# Altium schematic sheet MAX5875_3.SchDoc
size A; SheetNumber: 16; SheetTotal: 24
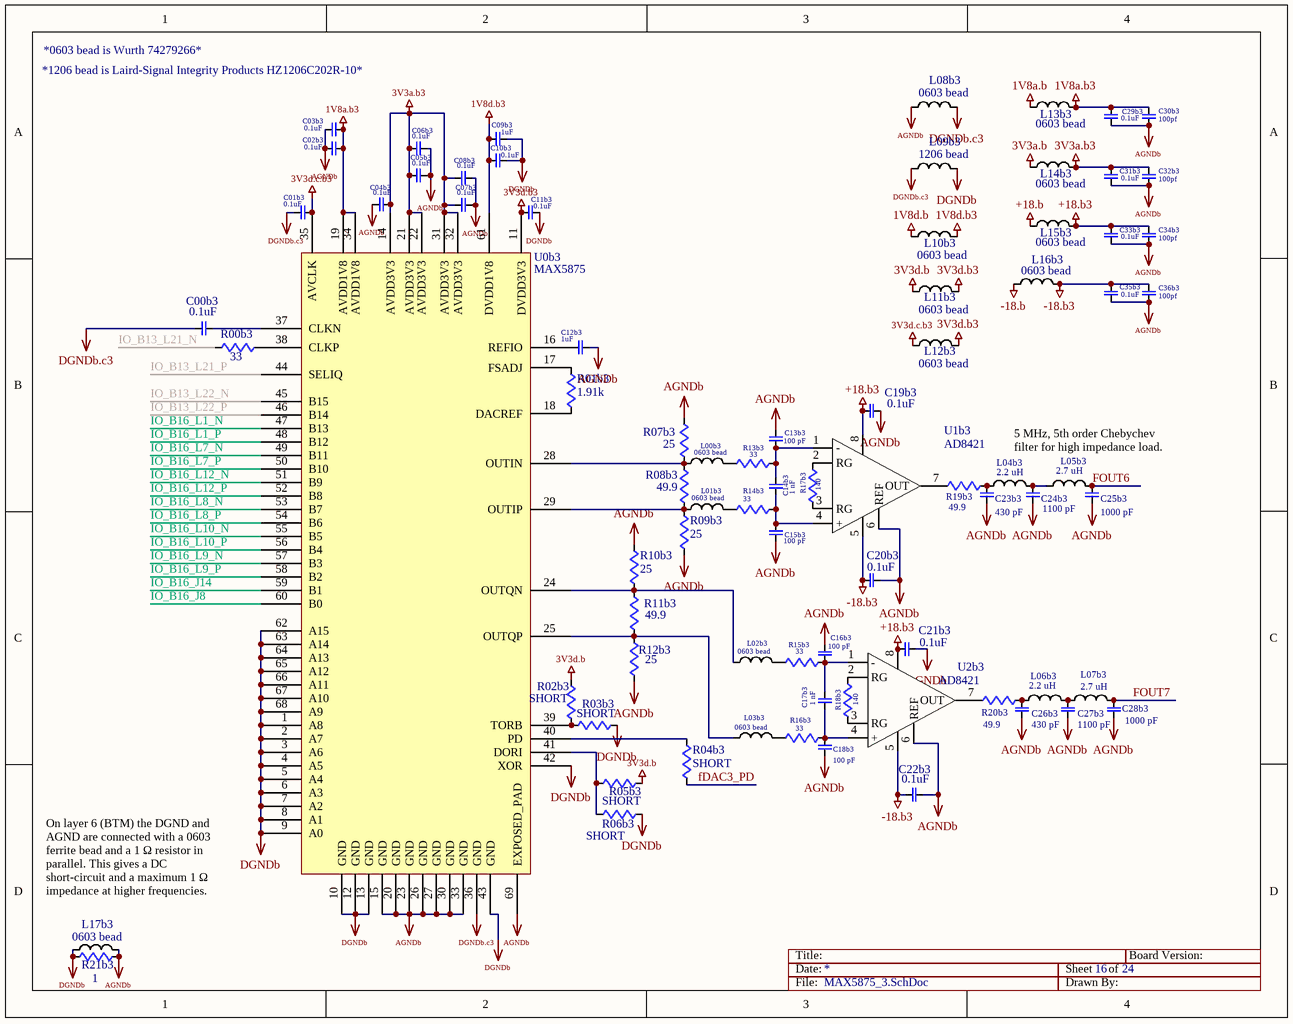
[diagram p0: MAX5875_3.SchDoc]

## Parts
C00b3  0.1uF  [0402]
C01b3  0.1uF  [0402]
C02b3  0.1uF  [0402]
C03b3  0.1uF  [0402]
C04b3  0.1uF  [0402]
C05b3  0.1uF  [0402]
C06b3  0.1uF  [0402]
C07b3  0.1uF  [0402]
C08b3  0.1uF  [0402]
C09b3  1uF  [0603]
C10b3  0.1uF  [0402]
C11b3  0.1uF  [0402]
C12b3  1uF  [0402]
C13b3  100 pF  [0603]
C14b3  1 nF  [0603]
C15b3  100 pF  [0603]
C16b3  100 pF  [0603]
C17b3  1 nF  [0603]
C18b3  100 pF  [0603]
C19b3  0.1uF  [0603]
C20b3  0.1uF  [0603]
C21b3  0.1uF  [0603]
C22b3  0.1uF  [0603]
C23b3  430 pF  [0603]
C24b3  1100 pF  [0603]
C25b3  1000 pF  [0603]
C26b3  430 pF  [0603]
C27b3  1100 pF  [0603]
C28b3  1000 pF  [0603]
C29b3  0.1uF  [0603]
C30b3  100pf  [0603]
C31b3  0.1uF  [0603]
C32b3  100pf  [0603]
C33b3  0.1uF  [0603]
C34b3  100pf  [0603]
C35b3  0.1uF  [0603]
C36b3  100pf  [0603]
L00b3  0603 bead  [0603]
L01b3  0603 bead  [0603]
L02b3  0603 bead  [0603]
L03b3  0603 bead  [0603]
L04b3  2.2 uH  [0603]
L05b3  2.7 uH  [0603]
L06b3  2.2 uH  [0603]
L07b3  2.7 uH  [0603]
L08b3  0603 bead  [0603]
L09b3  1206 bead  [1206]
L10b3  0603 bead  [0603]
L11b3  0603 bead  [0603]
L12b3  0603 bead  [0603]
L13b3  0603 bead  [0603]
L14b3  0603 bead  [0603]
L15b3  0603 bead  [0603]
L16b3  0603 bead  [0603]
L17b3  0603 bead  [0603]
R00b3  33  [0402]
R01b3  1.91k  [0603]
R02b3  SHORT  [0603]
R03b3  SHORT  [0603]
R04b3  SHORT  [0603]
R05b3  SHORT  [0603]
R06b3  SHORT  [0603]
R07b3  25  [0603]
R08b3  49.9  [0603]
R09b3  25  [0603]
R10b3  25  [0603]
R11b3  49.9  [0603]
R12b3  25  [0603]
R13b3  33  [0603]
R14b3  33  [0603]
R15b3  33  [0603]
R16b3  33  [0603]
R17b3  140  [0402]
R18b3  140  [0402]
R19b3  49.9  [0603]
R20b3  49.9  [0603]
R21b3  1  [0603]
U0b3  MAX5875  [68LQFN]
U1b3  AD8421  [8SOIC]
U2b3  AD8421  [8SOIC]

## Nets
1V8a.b: L13b3.1
1V8a.b3: C02b3.1 C03b3.2 C29b3.1 C30b3.1 L13b3.2 U0b3.19(AVDD1V8) U0b3.34(AVDD1V8)
1V8d.b: L10b3.1
1V8d.b3: C09b3.2 C10b3.2 L10b3.2 U0b3.61(DVDD1V8)
3V3a.b: L14b3.1
3V3a.b3: C04b3.1 C05b3.2 C06b3.1 C07b3.2 C08b3.1 C31b3.1 C32b3.1 L14b3.2 U0b3.14(AVDD3V3) U0b3.21(AVDD3V3) U0b3.22(AVDD3V3) U0b3.31(AVDD3V3) U0b3.32(AVDD3V3)
3V3d.b: L11b3.1 R02b3.2 R05b3.2
3V3d.b3: C11b3.2 L11b3.2 L12b3.2 U0b3.11(DVDD3V3)
3V3d.c.b3: C01b3.1 L12b3.1 U0b3.35(AVCLK)
+18.b: L15b3.1
+18.b3: C19b3.2 C21b3.2 C33b3.1 C34b3.1 L15b3.2 U1b3.8(+VS) U2b3.8(+VS)
-18.b: L16b3.1
-18.b3: C20b3.2 C22b3.2 C35b3.1 C36b3.1 L16b3.2 U1b3.5(-VS) U2b3.5(-VS)
AGNDb: C02b3.2 C03b3.1 C04b3.2 C05b3.1 C06b3.2 C07b3.1 C08b3.2 C12b3.1 C13b3.1 C15b3.1 C16b3.1 C18b3.1 C19b3.1 C20b3.1 C21b3.1 C22b3.1 C23b3.2 C24b3.2 C25b3.2 C26b3.2 C27b3.2 C28b3.2 C29b3.2 C30b3.2 C31b3.2 C32b3.2 C33b3.2 C34b3.2 C35b3.2 C36b3.2 L08b3.1 L17b3.2 R07b3.2 R09b3.1 R10b3.2 R12b3.1 R21b3.1 U0b3.15(GND) U0b3.20(GND) U0b3.23(GND) U0b3.26(GND) U0b3.27(GND) U0b3.30(GND) U0b3.33(GND) U0b3.69(EXPOSED_PAD) U1b3.6(REF) U2b3.6(REF)
DGNDb: C09b3.1 C10b3.1 C11b3.1 L09b3.2 L17b3.1 R03b3.2 R06b3.2 R21b3.2 U0b3.1(A8) U0b3.2(A7) U0b3.3(A6) U0b3.4(A5) U0b3.5(A4) U0b3.6(A3) U0b3.7(A2) U0b3.8(A1) U0b3.9(A0) U0b3.10(GND) U0b3.12(GND) U0b3.13(GND) U0b3.42(XOR) U0b3.43(GND) U0b3.62(A15) U0b3.63(A14) U0b3.64(A13) U0b3.65(A12) U0b3.66(A11) U0b3.67(A10) U0b3.68(A9)
DGNDb.c3: C00b3.2 C01b3.2 L08b3.2 L09b3.1 U0b3.36(GND)
fDAC3_PD: R04b3.2
FOUT6: C25b3.1 L05b3.2
FOUT7: C28b3.1 L07b3.2
IO_B13_L21_N: R00b3.1
IO_B13_L21_P: U0b3.44(SELIQ)
IO_B13_L22_N: U0b3.45(B15)
IO_B13_L22_P: U0b3.46(B14)
IO_B16_J8: U0b3.60(B0)
IO_B16_J14: U0b3.59(B1)
IO_B16_L1_N: U0b3.47(B13)
IO_B16_L1_P: U0b3.48(B12)
IO_B16_L7_N: U0b3.49(B11)
IO_B16_L7_P: U0b3.50(B10)
IO_B16_L8_N: U0b3.53(B7)
IO_B16_L8_P: U0b3.54(B6)
IO_B16_L9_N: U0b3.57(B3)
IO_B16_L9_P: U0b3.58(B2)
IO_B16_L10_N: U0b3.55(B5)
IO_B16_L10_P: U0b3.56(B4)
IO_B16_L12_N: U0b3.51(B9)
IO_B16_L12_P: U0b3.52(B8)
NetC00b3_1: C00b3.1 U0b3.37(CLKN)
NetC12b3_2: C12b3.2 U0b3.16(REFIO)
NetC13b3_2: C13b3.2 C14b3.1 R13b3.1 U1b3.1(-)
NetC14b3_2: C14b3.2 C15b3.2 R14b3.1 U1b3.4(+)
NetC16b3_2: C16b3.2 C17b3.1 R15b3.1 U2b3.1(-)
NetC17b3_2: C17b3.2 C18b3.2 R16b3.1 U2b3.4(+)
NetC23b3_1: C23b3.1 L04b3.1 R19b3.2
NetC24b3_1: C24b3.1 L04b3.2 L05b3.1
NetC26b3_1: C26b3.1 L06b3.1 R20b3.2
NetC27b3_1: C27b3.1 L06b3.2 L07b3.1
NetL00b3_1: L00b3.1 R07b3.1 R08b3.2 U0b3.28(OUTIN)
NetL00b3_2: L00b3.2 R13b3.2
NetL01b3_1: L01b3.1 R08b3.1 R09b3.2 U0b3.29(OUTIP)
NetL01b3_2: L01b3.2 R14b3.2
NetL02b3_1: L02b3.1 R10b3.1 R11b3.2 U0b3.24(OUTQN)
NetL02b3_2: L02b3.2 R15b3.2
NetL03b3_1: L03b3.1 R11b3.1 R12b3.2 U0b3.25(OUTQP)
NetL03b3_2: L03b3.2 R16b3.2
NetR00b3_2: R00b3.2 U0b3.38(CLKP)
NetR01b3_1: R01b3.1 U0b3.18(DACREF)
NetR01b3_2: R01b3.2 U0b3.17(FSADJ)
NetR02b3_1: R02b3.1 R03b3.1 U0b3.39(TORB)
NetR04b3_1: R04b3.1 U0b3.40(PD)
NetR05b3_1: R05b3.1 R06b3.1 U0b3.41(DORI)
NetR17b3_1: R17b3.1 U1b3.3(RG)
NetR17b3_2: R17b3.2 U1b3.2(RG)
NetR18b3_1: R18b3.1 U2b3.3(RG)
NetR18b3_2: R18b3.2 U2b3.2(RG)
NetR19b3_1: R19b3.1 U1b3.7(OUT)
NetR20b3_1: R20b3.1 U2b3.7(OUT)

## Notes on the sheet
- *1206 bead is Laird-Signal Integrity Products HZ1206C202R-10*
- *0603 bead is Wurth 74279266*
- 5 MHz, 5th order Chebychev filter for high impedance load.
- On layer 6 (BTM) the DGND and AGND are connected with a 0603 ferrite bead and a 1 Ω resistor in parallel. This gives a DC short-circuit and a maximum 1 Ω impedance at higher frequencies.
- Title:
- Date:
- Sheet
- of
- Board Version:
- File:
- Drawn By:

## Library data of the parts
C00b3 C01b3 C02b3 C03b3 C04b3 C05b3 C06b3 C07b3 C08b3 C09b3 C10b3 C11b3 C12b3 C13b3 C14b3 C15b3 C16b3 C17b3 C18b3 C19b3 C20b3 C21b3 C22b3 C23b3 C24b3 C25b3 C26b3 C27b3 C28b3 C29b3 C30b3 C31b3 C32b3 C33b3 C34b3 C35b3 C36b3 = CAP
L00b3 L01b3 L02b3 L03b3 L04b3 L05b3 L06b3 L07b3 L08b3 L09b3 L10b3 L11b3 L12b3 L13b3 L14b3 L15b3 L16b3 L17b3 = INDUCTOR
R00b3 R01b3 R02b3 R03b3 R04b3 R05b3 R06b3 R07b3 R08b3 R09b3 R10b3 R11b3 R12b3 R13b3 R14b3 R15b3 R16b3 R17b3 R18b3 R19b3 R20b3 R21b3 = RES